# EAGLE design small_laser_supply (EAGLE 9.0.1)
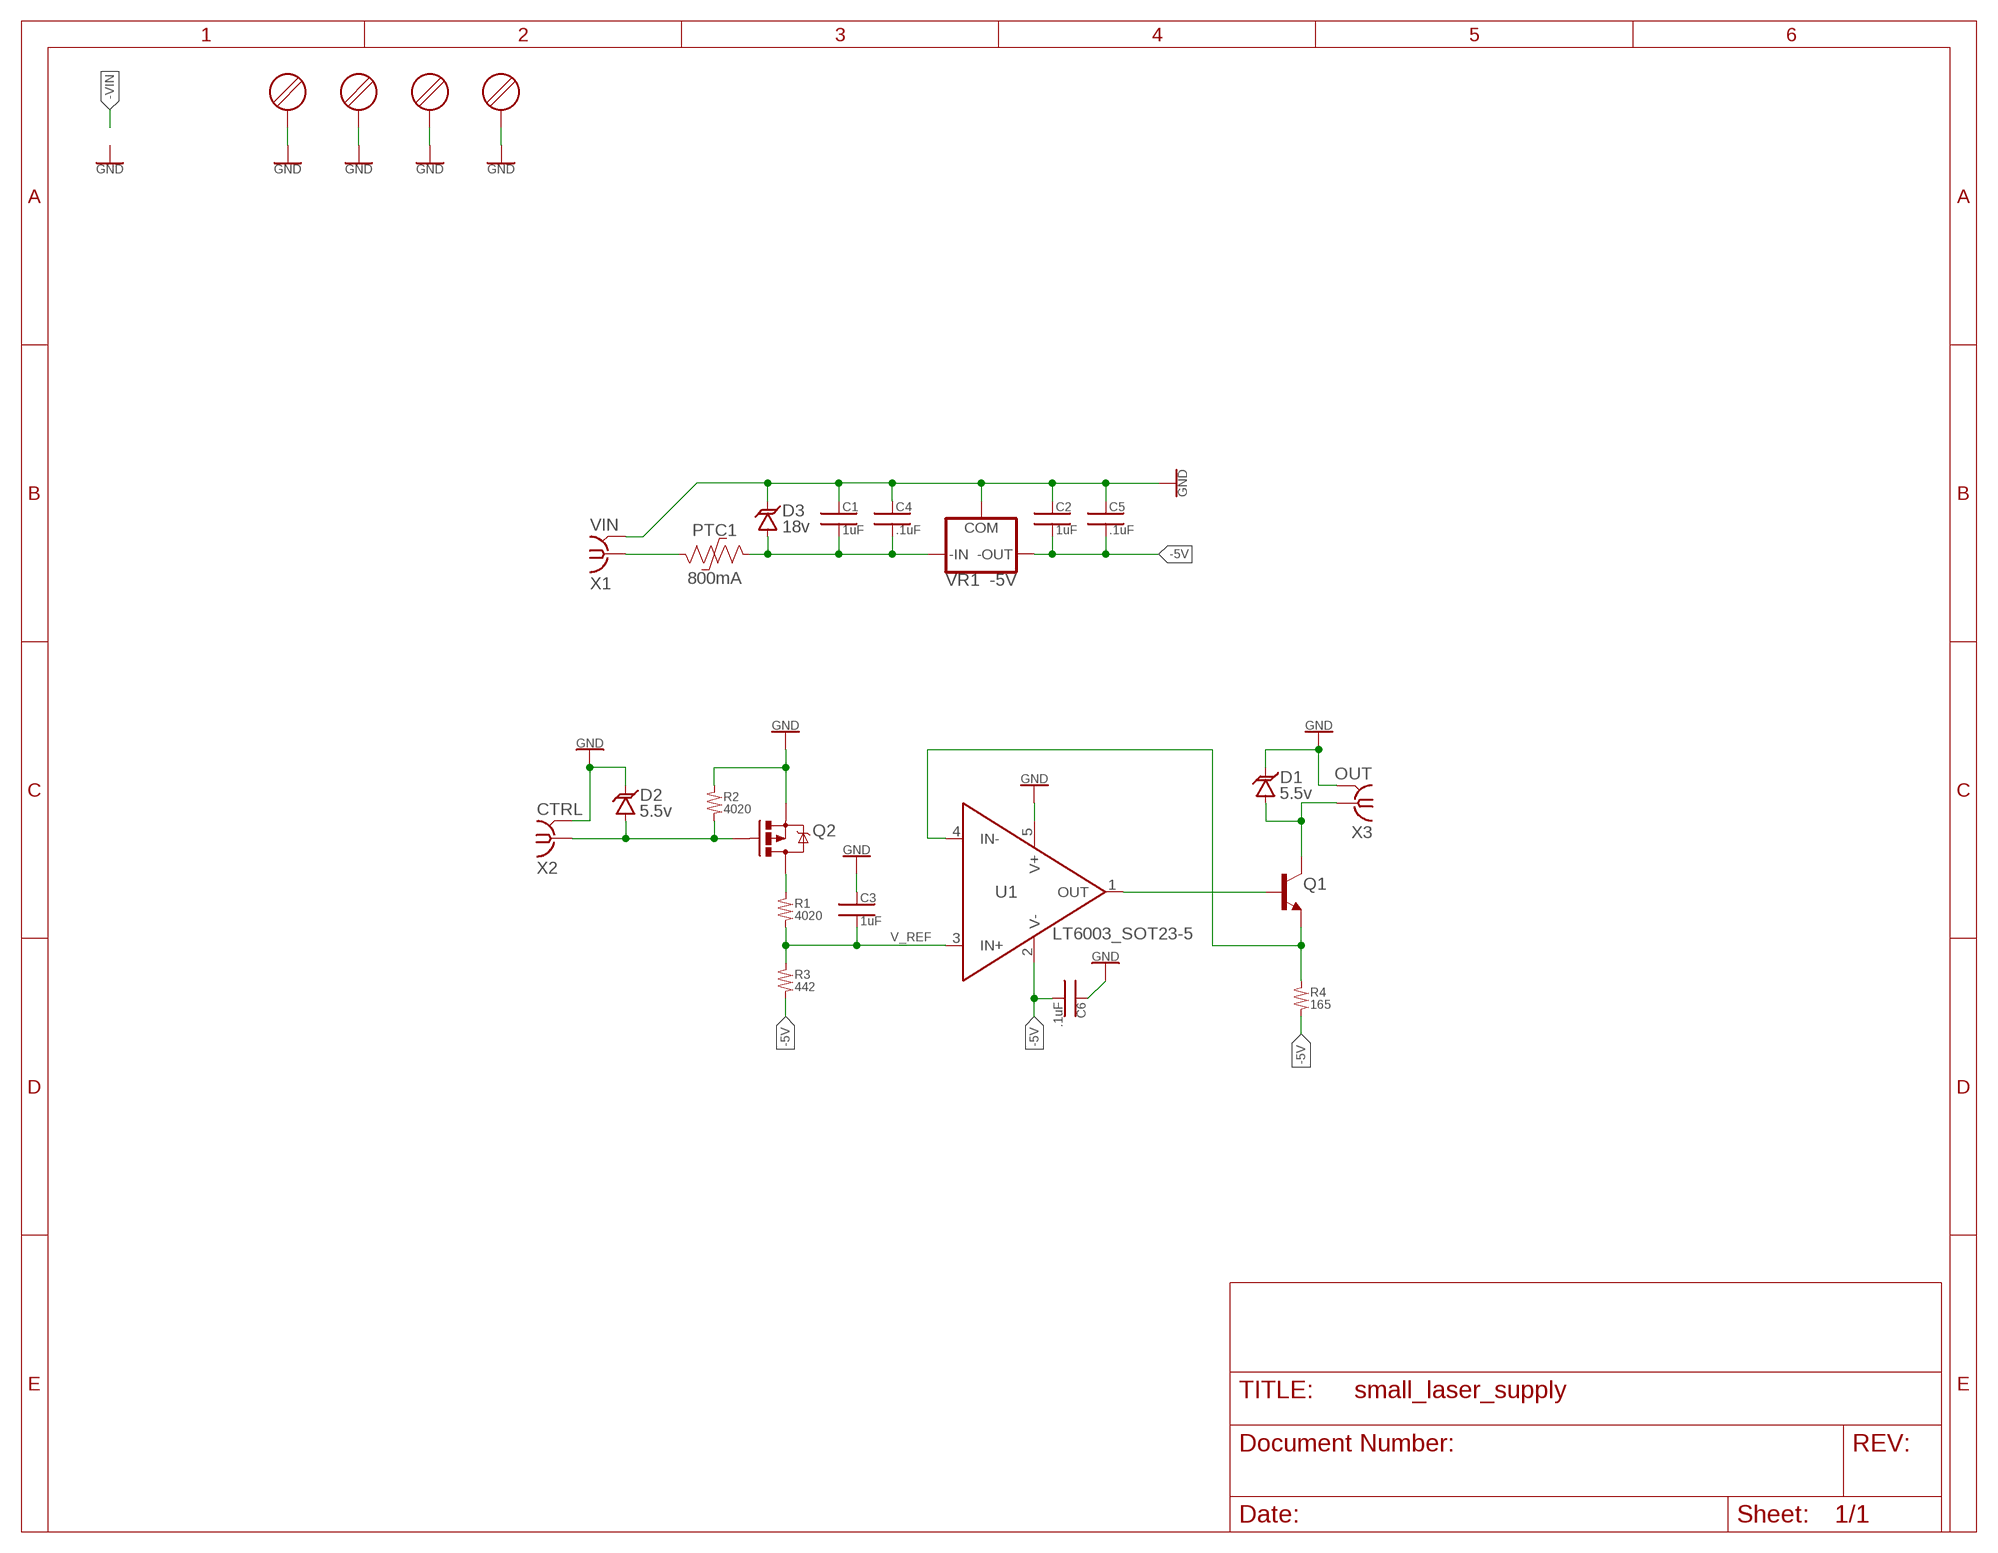
[diagram p0: schematic, sheet 1]

## Parts
C1  1uF  CAP_0603  [0603]
C2  1uF  CAP_0603  [0603]
C3  1uF  CAP_0603  [0603]
C4  .1uF  CAP_0603  [0603]
C5  .1uF  CAP_0603  [0603]
C6  .1uF  CAP_0603  [0603]
D1  5.5v  TVS-UNI_DO-214AA  [DO-214AA]
D2  5.5v  TVS-UNI_DO-214AA  [DO-214AA]
D3  18v  TVS-UNI_DO-214AA  [DO-214AA]
MH1  THREADED_INSERT_M3  [7466003R]
MH2  THREADED_INSERT_M3  [7466003R]
MH3  THREADED_INSERT_M3  [7466003R]
MH4  THREADED_INSERT_M3  [7466003R]
PTC1  800mA  PTC_2SMD  [2SMD_PTC]
Q1  BJT_NPN_SOT23-3  [SOT23-3]
Q2  MOSFET_P-CHANNEL_SOT23-3  [SOT23-3]
R1  4020  RES_0603  [0603]
R2  4020  RES_0603  [0603]
R3  442  RES_0603  [0603]
R4  165  RES_0603  [0603]
U1  LT6003_SOT23-5  [SOT23-5]
VR1  -5V  79XX_VREG_DPAK  [DPAK]
X1  VIN  BNC_TE-VERT-PTH  [5-1634503-1]
X2  CTRL  BNC_TE-VERT-PTH  [5-1634503-1]
X3  OUT  BNC_TE-VERT-PTH  [5-1634503-1]

## Nets
-5V: C2.2 C5.2 C6.2 R3.2 R4.2 U1.2(V-) VR1.3(OUT)
GND: C1.1 C2.1 C3.1 C4.1 C5.1 C6.1 D1.C D2.C D3.C MH1.P MH2.P MH3.P MH4.P Q2.2(S) R2.1 U1.5(V+) VR1.1(GND) X1.G1(GND) X1.G2(GND) X1.G3(GND) X1.G4(GND) X2.G1(GND) X2.G2(GND) X2.G3(GND) X2.G4(GND) X3.G1(GND) X3.G2(GND) X3.G3(GND) X3.G4(GND)
N$1: Q1.1(B) U1.1(OUT)
N$2: Q1.2(E) R4.1 U1.4(IN-)
N$3: Q2.3(D) R1.1
N$4: PTC1.1 X1.C
N$7: D1.A Q1.3(C) X3.C
N$8: C1.2 C4.2 D3.A PTC1.2 VR1.4(IN)
N$9: D2.A Q2.1(G) R2.2 X2.C
V_REF: C3.2 R1.2 R3.1 U1.3(IN+)

## Library data of the parts
C1-C6 = small_laser_supply_lib:CAP
D1-D3 = small_laser_supply_lib:TVS-UNI: Unidirectional Transient Voltage Suppressor
MH1-MH4 = small_laser_supply_lib:THREADED_INSERT
PTC1 = small_laser_supply_lib:PTC
Q1 = small_laser_supply_lib:BJT_NPN
Q2 = small_laser_supply_lib:MOSFET_P-CHANNEL
R1-R4 = small_laser_supply_lib:RES
U1 = small_laser_supply_lib:LT6003: OpAmp RrR 1.6v-16v Precision
VR1 = small_laser_supply_lib:79XX_VREG
X1-X3 = small_laser_supply_lib:BNC: BNC Connectors

## Board
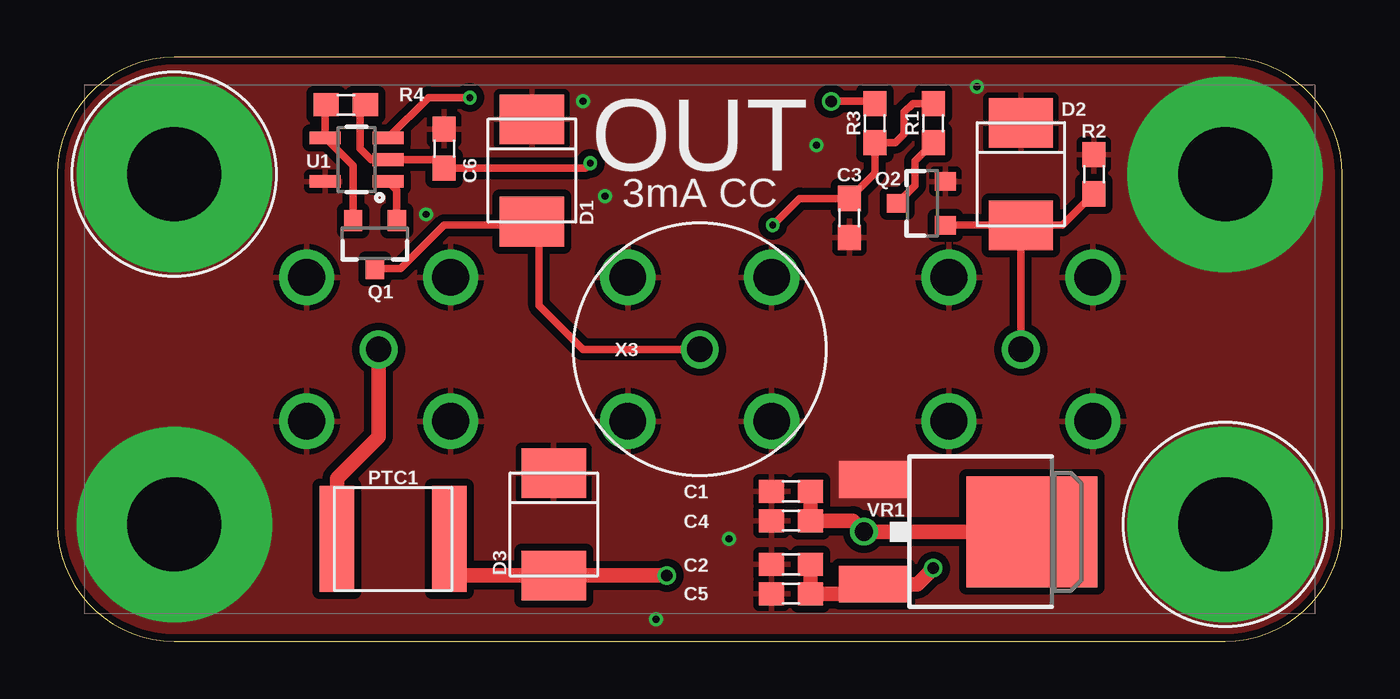
[diagram p1: board, top side]
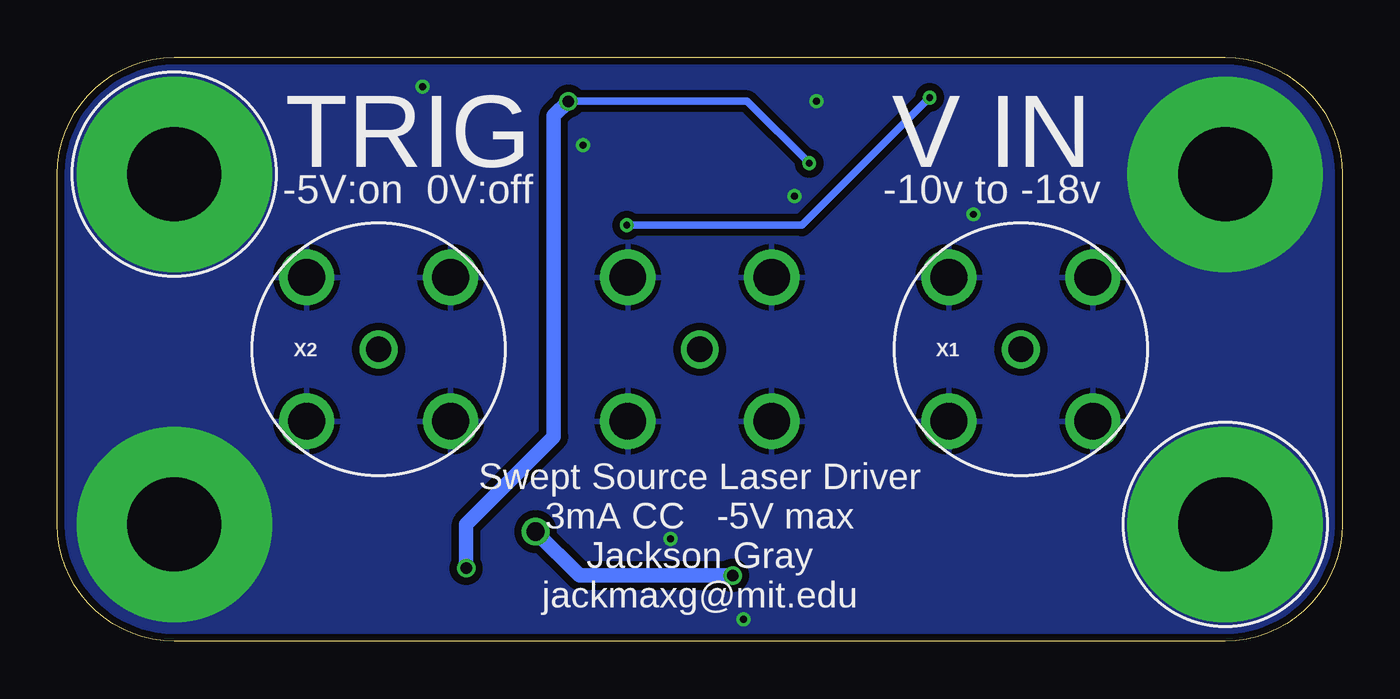
[diagram p2: board, bottom side, seen from below]

Size 55.88 x 25.4 mm. Coordinates in mm from the lower left corner, seen from the top.
Outline: 0,20.32 0,5.08 arc90 5.08,0 50.8,0 arc90 55.88,5.08 55.88,20.32 arc90 50.8,25.4 5.08,25.4 arc90 0,20.32
Copper layers (1*16): Top 0.035mm / dielectric 1.5mm / Bottom 0.035mm
Design rules "3PCB_2layer *": minimum track width 6mil, minimum drill 0.3mm, track to track 6mil, track to pad 6mil, pad to pad 6mil, via to via 6mil, smd to smd 6mil, copper to edge 6mil, drill to drill 6mil, minimum pad ring 6mil, minimum via ring 6mil, stop-mask expansion 4mil, vias tented up to drill 0mil, thermal gap 10mil

### Footprints (pad centres in the part's own frame; a part is rotated, then mirrored left to right if it is on the bottom)
0603 = smd 1.1 x 1: 1 -0.85,0; 2 0.85,0
DO-214AA = smd 2.16 x 2.8: A -2.225,0; C 2.225,0
7466003R = drill 4.1 pad 8.5: P 0,0
2SMD_PTC = smd 1.5 x 4.6: 1 -2.45,0; 2 2.45,0
SOT23-3 = smd 0.8 x 0.9: 1 -0.95,-1; 2 0.95,-1; 3 0,1.1
SOT23-5 = smd 0.55 x 1.35: 1 -0.95,-1.375; 2 0,-1.375; 3 0.95,-1.375; 4 0.95,1.375; 5 -0.95,1.375
DPAK = smd 1.6 x 3: 1 -2.28,-5.31; 3 2.28,-5.31 | smd 4.826 x 5.715: 4 0,1.588
5-1634503-1 = drill 1.1: C 0,0 | drill 1.6: G1 -3.13,3.13; G2 3.13,3.13; G3 -3.13,-3.13; G4 3.13,-3.13

### Placement (x,y rotation side)
C1  31.91,6.51 0 top
C2  31.91,3.33 0 top
C3  34.45,18.41 90 top
C4  31.91,5.24 0 top
C5  31.91,2.06 0 top
C6  16.83,21.43 270 top
D1  20.64,20.48 90 top
D2  41.91,20.32 90 top
D3  21.59,5.08 90 top
MH1  50.8,20.32 0 bottom
MH2  5.08,20.32 0 top
MH3  50.8,5.08 0 top
MH4  5.08,5.08 0 bottom
PTC1  14.61,4.45 0 top
Q1  13.81,17.3 180 top
Q2  37.62,19.05 90 top
R1  38.1,22.54 90 top
R2  45.09,20.32 270 top
R3  35.56,22.54 90 top
R4  12.54,23.34 0 top
U1  13.02,20.95 90 top
VR1  40.8,4.76 270 top
X1  13.97,12.7 0 bottom
X2  41.91,12.7 0 bottom
X3  27.94,12.7 0 top

### Tracks (layer width: path | path; a pad name or v marks a point on that pad's centre or on a via)
-5V  (via drill 0.3, 0.5)
  Top 0.318: R4.2 13.18,23.12 13.18,21.43 13.65,20.95 U1.2 16.45,20.95 C6.2 22.96,20.58 v23.18,20.8 | v33.66,23.5 35.46,23.5 R3.2
  Top 0.635: C2.2 C5.2 35.07,2.06 VR1.3 37.41,2.48 v38.1,3.17
  Bottom 0.318: v23.18,20.8 25.88,23.5 v33.66,23.5
  Bottom 0.635: v38.1,3.17 38.1,5.08 34.29,8.89 34.29,22.86 v33.66,23.5
GND  (via drill 0.3)
  other vias: 22.86,23.5 33.02,21.59 23.81,19.37 40.01,24.13 26.04,0.95 29.21,4.45 16.03,18.57
  pour Bottom (isolate 0.318): -2.54,-2.54 -2.54,27.94 58.42,27.94 58.42,-2.54
  pour Top (isolate 0.318): -1.27,-1.27 57.15,-1.27 57.15,26.67 -1.27,26.67
N$1
  Top 0.318: U1.1 14.76,19.64 Q1.1
N$2
  Top 0.318: R4.1 11.64,23.29 U1.4 12.86,20.69 Q1.2
N$3
  Top 0.318: Q2.3 37.31,19.83 37.31,20.9 R1.1
N$4
  Top 0.635: X1.C 13.97,8.89 12.15,7.08 PTC1.1
N$7
  Top 0.318: X3.C 22.86,12.7 20.95,14.61 20.95,18.1 | 20.95,18.1 D1.A | Q1.3 14.93,16.2 16.83,18.1 20.95,18.1
N$8  (via drill 0.5, 0.8)
  Top 0.635: C1.2 C4.2 34.61,5.24 v35.08,4.76 VR1.4 | v26.51,2.85 D3.A 17.46,2.85 17.05,3.27 PTC1.2
  Bottom 0.635: v35.08,4.76 33.18,2.85 v26.51,2.85
N$9
  Top 0.318: X2.C D2.A | D2.A Q2.1 | R2.2 43.71,18.09 D2.A
V_REF  (via drill 0.3)
  Top 0.318: R1.2 37.2,23.39 36.83,23.02 36.83,22.07 36.46,21.69 R3.1 35.56,20.38 C3.2 32.28,19.27 v31.11,18.1 | U1.3 16.14,23.65 v17.94,23.65
  Bottom 0.318: v17.94,23.65 23.5,18.1 v31.11,18.1

### Text on the board
tPlace: OUT | 3mA CC
bPlace: V IN | TRIG | -10v to -18v | -5V:on 0V:off | Swept Source Laser Driver / 3mA CC -5V max / Jackson Gray / jackmaxg@mit.edu